# Altium schematic sheet TVS Diode.schdoc
size 124 x 101 mm
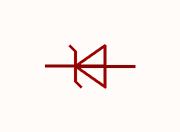
[diagram p0: TVS Diode.schdoc]

## Parts
D?  SMBJ9.0A  [SMB_L4.5-W3.7-LS5.4-RD]  (value not drawn)

## Nets

Not connected (* = marked no-connect by the designer): D? 1 2

## Library data of the parts
D? = SMBJ9.0A_C908790: Manufacturer: GOODWORK(固得沃克); Add into BOM: yes; Reverse Stand-Off Voltage (Vrwm): 9V; Maximum Clamping Voltage: 15.4V; Peak Pulse Current (Ipp)@10/1000us: 39A; Peak Pulse Power Dissipation (Ppp)@10/1000us: 600W; Breakdown Voltage: 10V; Reverse Leakage Current (Ir): 5uA; Type: TVS; Symbol: SMBJ9.0A_C908790; Device: SMBJ9.0A_C908790; LCSC Part Name: SMBJ9.0A; Supplier Part: C908790; Manufacturer Part: SMBJ9.0A; Supplier Footprint: SMB(DO-214AA); JLCPCB Part Class: Extended Part; Datasheet: https://atta.szlcsc.com/upload/public/pdf/source/20240508/1CA20C3E2CA17788E1A78E427E8A26EF.pdf; Supplier: LCSC; Convert to PCB: yes; Operating Temperature: -55℃~+150℃@(Tj)